# Altium project ws2812b_driver.PrjPcb
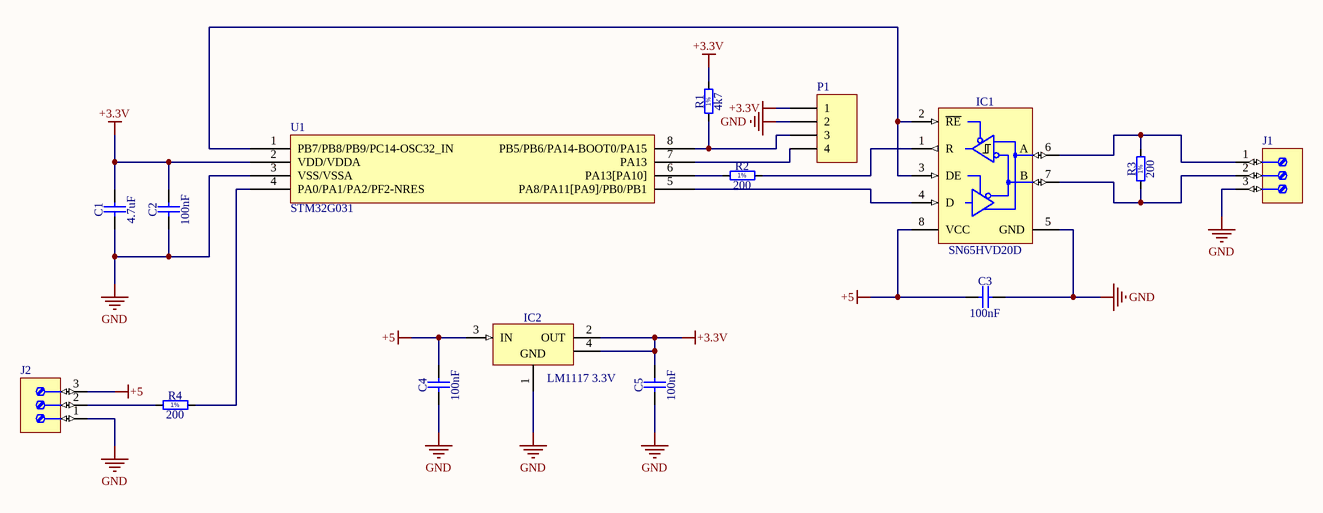
[diagram p0: Sheet1.SchDoc]
1 sheet, 15 parts. Net scope: global (net labels, ports and power ports of the same name join across sheets).
Board files: PCB1.PcbDoc, PCB2.PcbDoc

## Sheet Sheet1.SchDoc
size A4; SheetNumber: 1; SheetTotal: 1

### Parts
C1  4.7uF  [CAPC2012X135N]
C2  100nF  [CAPC2012X135N]
C3  100nF  [CAPC2012X135N]
C4  100nF  [CAPC2012X135N]
C5  100nF  [CAPC2012X135N]
IC1  SN65HVD20D  [SOIC127P600X175-8N]
IC2  LM1117 3.3V  [SOT230P700X180-4N]
J1  (no value)  [PHOENIX_1707917]
J2  (no value)  [PHOENIX_1707917]
P1  Header 4  [HDR1X4]  (value not drawn)
R1  4k7  [RESC2012X60N]
R2  200  [RESC2012X60N]
R3  200  [RESC2012X60N]
R4  200  [RESC2012X60N]
U1  STM32G031  [ST SOIC-8N]

### Nets
+3.3V: C1.2 C2.2 C5.2 IC2.2(OUT) IC2.4(OUT) P1.1 R1.2 U1.2(VDD/VDDA)
+5: C3.1 C4.2 IC1.8(VCC) IC2.3(IN) J2.3
GND: C1.1 C2.1 C3.2 C4.1 C5.1 IC1.5(GND) IC2.1(GND) J1.3 J2.1 P1.2 U1.3(VSS/VSSA)
NetIC1_1: IC1.1(R) R2.2
NetIC1_2: IC1.2(~{RE}) IC1.3(DE) U1.1(PB7/PB8/PB9/PC14-OSC32_IN)
NetIC1_4: IC1.4(D) U1.5(PA8/PA11[PA9]/PB0/PB1)
NetIC1_6: IC1.6(A) J1.1 R3.2
NetIC1_7: IC1.7(B) J1.2 R3.1
NetJ2_2: J2.2 R4.1
NetP1_3: P1.3 R1.1 U1.8(PB5/PB6/PA14-BOOT0/PA15)
NetP1_4: P1.4 U1.7(PA13)
NetR2_1: R2.1 U1.6(PA13[PA10])
NetR4_2: R4.2 U1.4(PA0/PA1/PA2/PF2-NRES)

### Notes on the sheet
- (in symbol R0805_4K7_1%_0.125W_100PPM) 1%
- (in symbol R0805_200R_1%_0.125W_100PPM) 1%

### Library data of the parts
C1 = CC0805_4.7UF_16V_10%_X7R: Non-polarised capacitor; Part Description: SMD Multilayer Chip Ceramic Capacitor; Manufacturer: GENERIC; Manufacturer1 Part Number: EMK212B7475KG-T; Voltage: 16V; TC: X7R; Tolerance: ±10%; Part Number: CC0805_4.7UF_16V_10%_X7R; Component Kind: Standard; Component Type: Standard; Pin Count: 2; Value: 4.7uF; Status: Preferred; Manufacturer Part Number: CC0805_4.7UF_16V_10%_X7R; Case: 0805; Mounted: Yes; Socket: No; SMD: Yes; Sense: No; Manufacturer1 Example: TAIYO YUDEN; Manufacturer1 ComponentHeight: 1.35mm; HelpURL: \\cern.ch\dfs\Applications\Altium\Datasheets\CC0805_X7R_TAIYO-YUDEN_HIGH-VALUE.pdf; Author: CERN DEM JLC; CreateDate: 16.09.2014; LatestRevisionDate: 16.09.2014
C2-C5 = CC0805_100NF_50V_10%_X7R: Non-polarised capacitor; Part Description: SMD Multilayer Chip Ceramic Capacitor; Manufacturer: GENERIC; Manufacturer1 Part Number: C2012X7R1H104K085AA; Voltage: 50V; TC: X7R; Tolerance: ±10%; Part Number: CC0805_100NF_50V_10%_X7R; Component Kind: Standard; Component Type: Standard; Pin Count: 2; Value: 100nF; Status: Preferred; Manufacturer Part Number: CC0805_100NF_50V_10%_X7R; Case: 0805; Mounted: Yes; Socket: No; SMD: Yes; Sense: No; Manufacturer1 Example: TDK; Manufacturer1 ComponentHeight: 1mm; HelpURL: \\cern.ch\dfs\Applications\Altium\Datasheets\CC0805_X7R_TDK_C.pdf; Author: CERN DEM JLC; CreateDate: 03.12.2007; LatestRevisionDate: 22.04.2015
IC1 = SN65HVD20D: Extended Common-Mode RS-485 Transceiver; Part Description: 25Mbps Extended Common-Mode RS-485 Transceiver; Manufacturer: TEXAS INSTRUMENTS; PressFit: No; Bonding: No; Part Number: SN65HVD20D; Component Kind: Standard; Component Type: Standard; Device: SN65HVD20D; PackageDescription: SOIC 8, Pitch 1.27mm - Body 4x5mm, IPC Medium Density; Manufacturer Part Number: SN65HVD20D; Pin Count: 8; Case: SOIC8; Mounted: Yes; Socket: No; SMD: Yes; Sense: No; ComponentHeight: 1.75mm; Author: CERN DEM JLC; HelpURL: \\cern.ch\dfs\Applications\Altium\Datasheets\SN65HVD20D.pdf; CreateDate: 29.10.2013; LatestRevisionDate: 29.10.2013
IC2 = LM1117MP-1.8/NOPB: 3-Terminal Regulator 1=GND 2=OUT 3=IN 4=OUT; Part Description: 1.8V 800mA Low-Dropout Linear Regulator; Manufacturer: TEXAS INSTRUMENTS; PressFit: No; Bonding: No; Part Number: LM1117MP-1.8/NOPB; Component Kind: Standard; Component Type: Standard; Device: LM1117MP-1.8/NOPB; PackageDescription: SOT223, 2.30mm pitch; 3 pin, 3.70mm W X 6.70mm L, IPC Medium Density; Manufacturer Part Number: LM1117MP-1.8/NOPB; Pin Count: 4; Case: SOT223; Mounted: Yes; Socket: No; SMD: Yes; Sense: No; ComponentHeight: 1.8mm; HelpURL: \\cern.ch\dfs\Applications\Altium\Datasheets\LM1117MP-1.8-NOPB.pdf; Author: CERN DEM JLC; CreateDate: 18.01.2011; LatestRevisionDate: 16.09.2014
J1 J2 = PHOENIX_1707917: Terminal Block, 3 Positions, Screw Connection; Part Description: 24A, 400V, Terminal Block, Pitch 5.08mm, 3 Positions, Screw Connection; Manufacturer: PHOENIX CONTACT; Manufacturer Part Number: 1707917 (MKDS 3/ 3-B-5,08); PressFit: No; Part Number: PHOENIX_1707917; Component Kind: Standard; Component Type: Standard; Pin Count: 3; Mounted: Yes; Socket: No; SMD: No; Sense: No; Status: None; ComponentHeight: 18mm; HelpURL: \\cern.ch\dfs\Applications\Altium\Datasheets\PHOENIX_1707917.pdf; Author: CERN DEM JLC; CreateDate: 04.12.2013; LatestRevisionDate: 04.12.2013
P1 = Header 4: Header, 4-Pin; LatestRevisionDate: 17-Jul-2002; LatestRevisionNote: Re-released for DXP Platform.; Publisher: Altium Limited
R1 = R0805_4K7_1%_0.125W_100PPM: Resistor - 1%; Part Description: General Purpose Thick Film Chip Resistor; Manufacturer: GENERIC; Manufacturer1 Part Number: NRC10F4701TRF; Power: 0.125W; TC: ±100ppm/°C; PressFit: No; Part Number: R0805_4K7_1%_0.125W_100PPM; Component Kind: Standard; Component Type: Standard; Pin Count: 2; Value: 4k7; Status: Preferred; Tolerance: ±1%; Manufacturer Part Number: R0805_4K7_1%_0.125W_100PPM; Case: 0805; Mounted: Yes; Sense: No; Socket: No; SMD: Yes; Manufacturer1 Example: NIC COMPONENT; Manufacturer1 ComponentHeight: 0.6mm; HelpURL: \\cern.ch\dfs\Applications\Altium\Datasheets\R0805_NIC_NRC.pdf; Author: CERN DEM JLC; CreateDate: 03.12.2007; LatestRevisionDate: 13.03.2008
R2-R4 = R0805_200R_1%_0.125W_100PPM: Resistor - 1%; Part Description: General Purpose Thick Film Chip Resistor; Manufacturer: GENERIC; Manufacturer1 Part Number: NRC10F2000TRF; Power: 0.125W; TC: ±100ppm/°C; PressFit: No; Part Number: R0805_200R_1%_0.125W_100PPM; Component Kind: Standard; Component Type: Standard; Pin Count: 2; Value: 200; Status: Preferred; Tolerance: ±1%; Manufacturer Part Number: R0805_200R_1%_0.125W_100PPM; Case: 0805; Mounted: Yes; Sense: No; Socket: No; SMD: Yes; Manufacturer1 Example: NIC COMPONENT; Manufacturer1 ComponentHeight: 0.6mm; HelpURL: \\cern.ch\dfs\Applications\Altium\Datasheets\R0805_NIC_NRC.pdf; Author: CERN DEM JLC; CreateDate: 03.12.2007; LatestRevisionDate: 13.03.2008